# Altium schematic sheet CPU LPDDR4.SchDoc: CPU DDR
size A3; DrawnBy: UKAYACIK; Engineer: UKAYACIK; DocumentNumber: 4; Revision: B; SheetNumber: 5; SheetTotal: 21
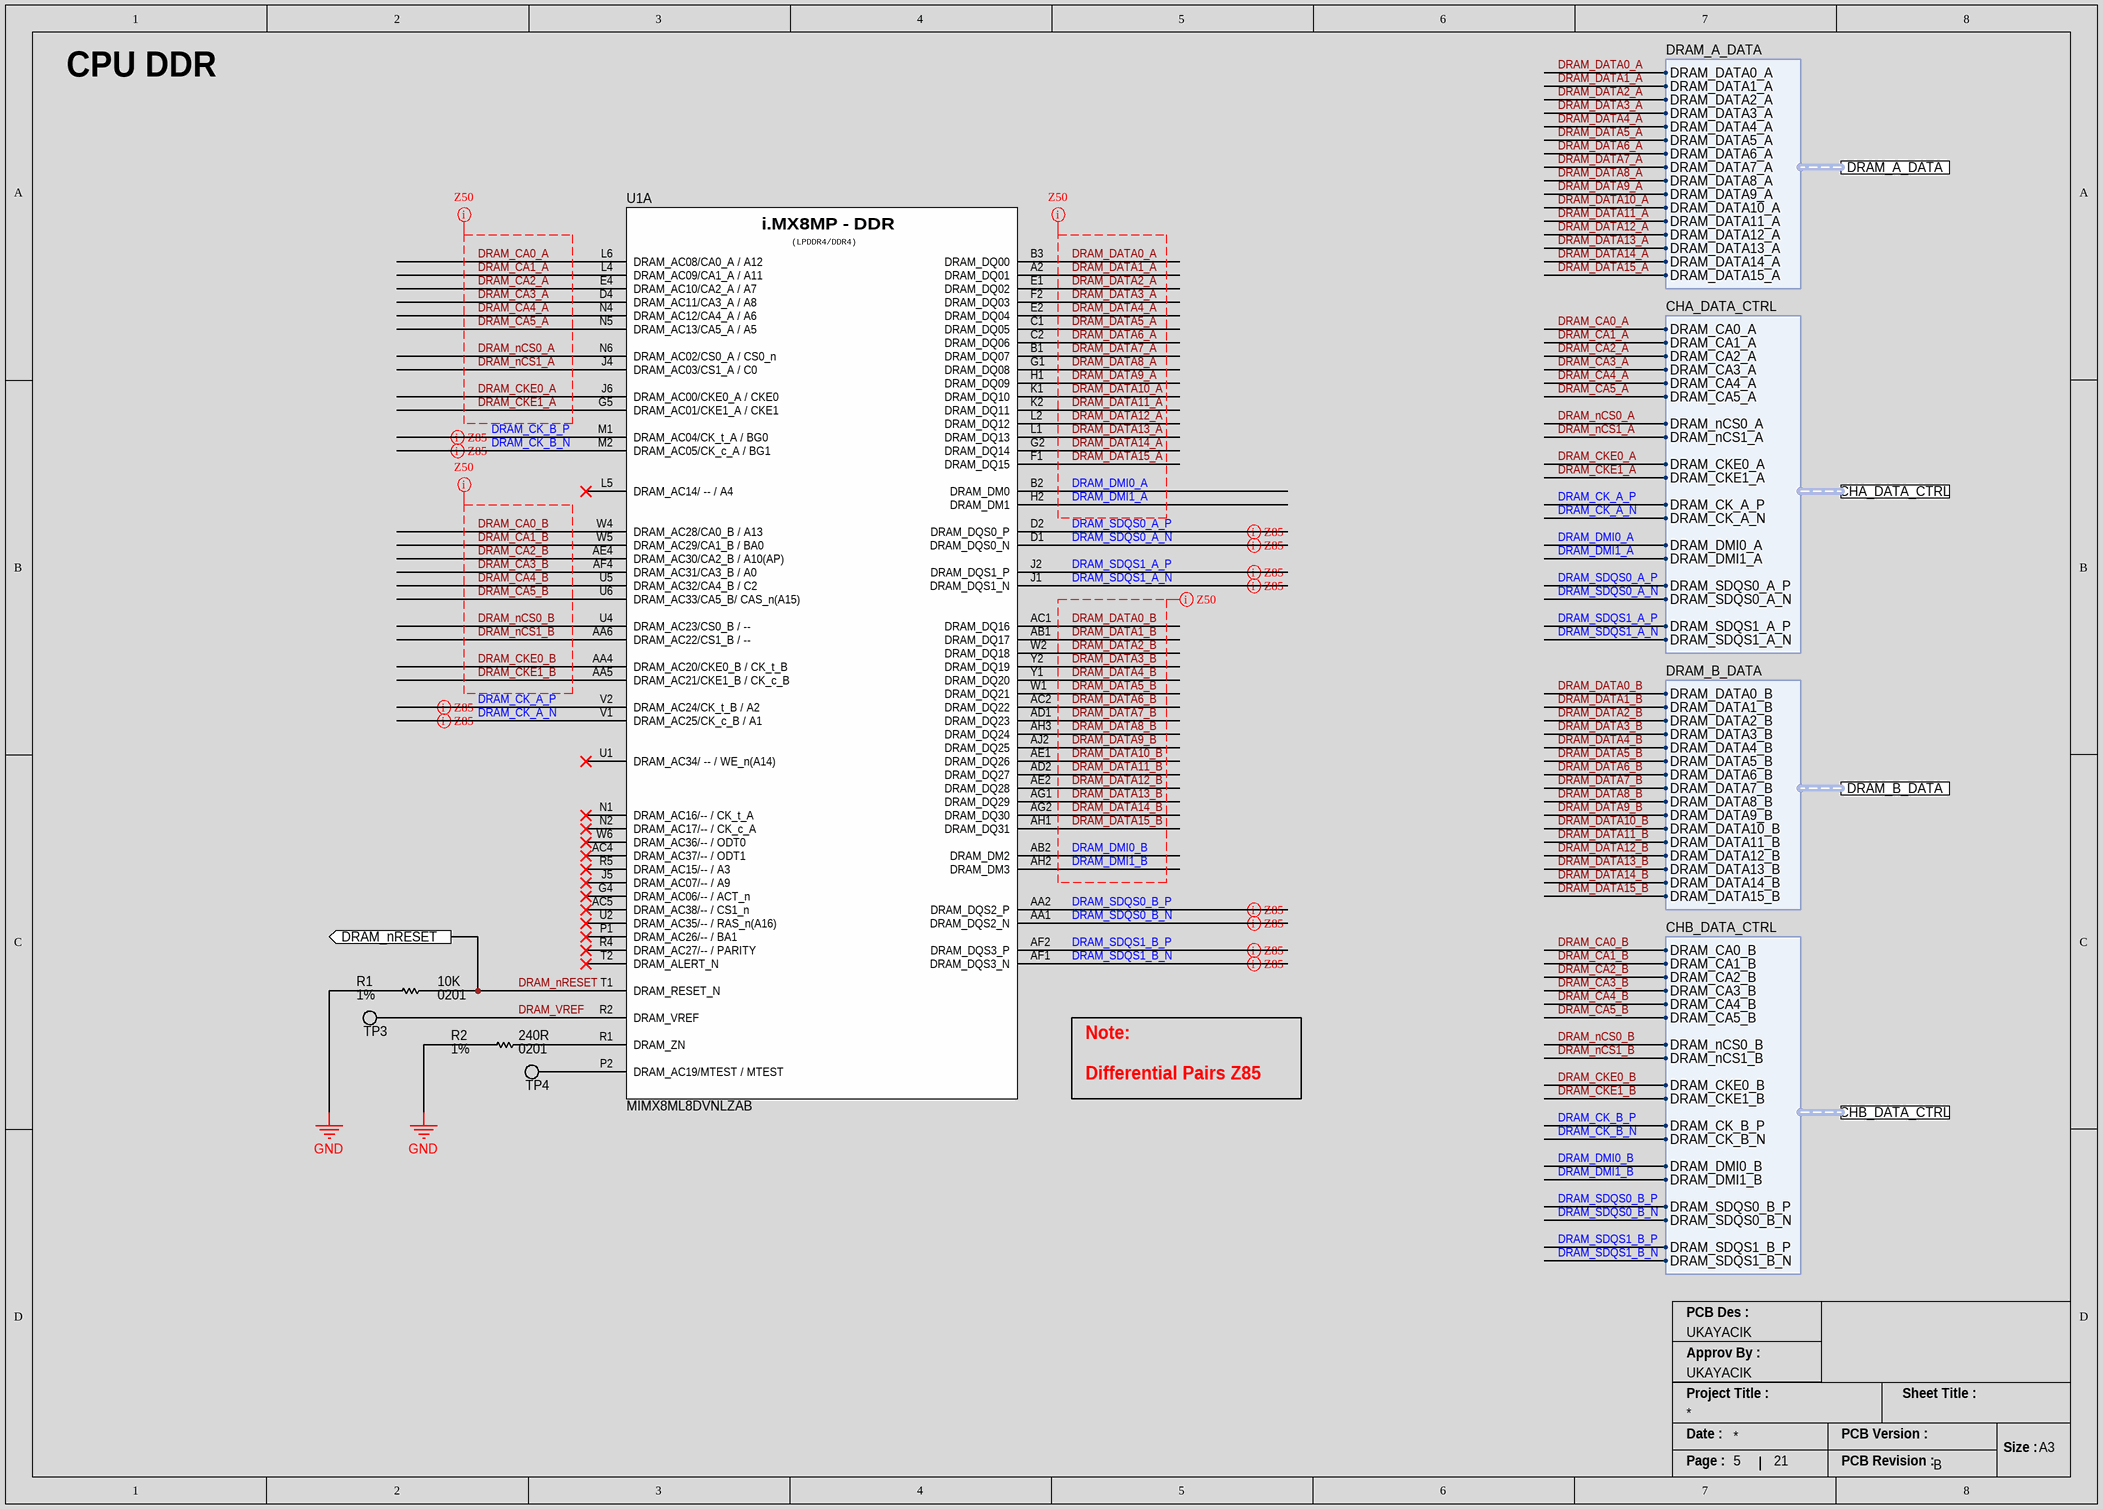
[diagram p0: CPU LPDDR4.SchDoc]

## Parts
R1  Tolerance: 1%  Resistance: 10K  Case Code (Imperial): 0201  [RES_0201_RESC0603X02N]  (hidden comment: RC0201FR-0710KL)
R2  Tolerance: 1%  Resistance: 240R  Case/Package: 0201  [RES_0201_RESC0603X02N]  (hidden comment: RC0201FR-07240RL)
TP3  NO COMPONENT  [TP_PAD_0.5MM_SMD_ROUND]  (value not drawn)  (no BOM)
TP4  NO COMPONENT  [TP_PAD_0.5MM_SMD_ROUND]  (value not drawn)  (no BOM)
U1  MIMX8ML8DVNLZAB  [IC_MPU_BGA548C50P29X29_1500X1500X148]  (part A of 15)

## Ports
CHA_DATA_CTRL (harness CHA_DATA_CTRL), CHB_DATA_CTRL (harness CHB_DATA_CTRL), DRAM_A_DATA (harness DRAM_A_DATA), DRAM_B_DATA (harness DRAM_B_DATA), DRAM_nRESET (out)

## Harnesses
DRAM_A_DATA: DRAM_DATA0_A, DRAM_DATA1_A, DRAM_DATA2_A, DRAM_DATA3_A, DRAM_DATA4_A, DRAM_DATA5_A, DRAM_DATA6_A, DRAM_DATA7_A, DRAM_DATA8_A, DRAM_DATA9_A, DRAM_DATA10_A, DRAM_DATA11_A, DRAM_DATA12_A, DRAM_DATA13_A, DRAM_DATA14_A, DRAM_DATA15_A
CHA_DATA_CTRL: DRAM_CA0_A, DRAM_CA1_A, DRAM_CA2_A, DRAM_CA3_A, DRAM_CA4_A, DRAM_CA5_A, DRAM_nCS0_A, DRAM_nCS1_A, DRAM_CKE0_A, DRAM_CKE1_A, DRAM_CK_A_P, DRAM_CK_A_N, DRAM_DMI0_A, DRAM_DMI1_A, DRAM_SDQS0_A_P, DRAM_SDQS0_A_N, DRAM_SDQS1_A_P, DRAM_SDQS1_A_N
DRAM_B_DATA: DRAM_DATA0_B, DRAM_DATA1_B, DRAM_DATA2_B, DRAM_DATA3_B, DRAM_DATA4_B, DRAM_DATA5_B, DRAM_DATA6_B, DRAM_DATA7_B, DRAM_DATA8_B, DRAM_DATA9_B, DRAM_DATA10_B, DRAM_DATA11_B, DRAM_DATA12_B, DRAM_DATA13_B, DRAM_DATA14_B, DRAM_DATA15_B
CHB_DATA_CTRL: DRAM_CA0_B, DRAM_CA1_B, DRAM_CA2_B, DRAM_CA3_B, DRAM_CA4_B, DRAM_CA5_B, DRAM_nCS0_B, DRAM_nCS1_B, DRAM_CKE0_B, DRAM_CKE1_B, DRAM_CK_B_P, DRAM_CK_B_N, DRAM_DMI0_B, DRAM_DMI1_B, DRAM_SDQS0_B_P, DRAM_SDQS0_B_N, DRAM_SDQS1_B_P, DRAM_SDQS1_B_N

## Nets
GND: R1.1 R2.1
DRAM_CA0_A: U1.L6(DRAM_AC08/CA0_A_/_A12) ; port CHA_DATA_CTRL.DRAM_CA0_A
DRAM_CA0_B: U1.W4(DRAM_AC28/CA0_B_/_A13) ; port CHB_DATA_CTRL.DRAM_CA0_B
DRAM_CA1_A: U1.L4(DRAM_AC09/CA1_A_/_A11) ; port CHA_DATA_CTRL.DRAM_CA1_A
DRAM_CA1_B: U1.W5(DRAM_AC29/CA1_B_/_BA0) ; port CHB_DATA_CTRL.DRAM_CA1_B
DRAM_CA2_A: U1.E4(DRAM_AC10/CA2_A_/_A7) ; port CHA_DATA_CTRL.DRAM_CA2_A
DRAM_CA2_B: U1.AE4(DRAM_AC30/CA2_B_/_A10(AP)) ; port CHB_DATA_CTRL.DRAM_CA2_B
DRAM_CA3_A: U1.D4(DRAM_AC11/CA3_A_/_A8) ; port CHA_DATA_CTRL.DRAM_CA3_A
DRAM_CA3_B: U1.AF4(DRAM_AC31/CA3_B_/_A0) ; port CHB_DATA_CTRL.DRAM_CA3_B
DRAM_CA4_A: U1.N4(DRAM_AC12/CA4_A_/_A6) ; port CHA_DATA_CTRL.DRAM_CA4_A
DRAM_CA4_B: U1.U5(DRAM_AC32/CA4_B_/_C2) ; port CHB_DATA_CTRL.DRAM_CA4_B
DRAM_CA5_A: U1.N5(DRAM_AC13/CA5_A_/_A5) ; port CHA_DATA_CTRL.DRAM_CA5_A
DRAM_CA5_B: U1.U6(DRAM_AC33/CA5_B/_CAS_n(A15)) ; port CHB_DATA_CTRL.DRAM_CA5_B
DRAM_CK_A_N: U1.V1(DRAM_AC25/CK_c_B_/_A1) ; port CHA_DATA_CTRL.DRAM_CK_A_N
DRAM_CK_A_P: U1.V2(DRAM_AC24/CK_t_B_/_A2) ; port CHA_DATA_CTRL.DRAM_CK_A_P
DRAM_CK_B_N: U1.M2(DRAM_AC05/CK_c_A_/_BG1) ; port CHB_DATA_CTRL.DRAM_CK_B_N
DRAM_CK_B_P: U1.M1(DRAM_AC04/CK_t_A_/_BG0) ; port CHB_DATA_CTRL.DRAM_CK_B_P
DRAM_CKE0_A: U1.J6(DRAM_AC00/CKE0_A_/_CKE0) ; port CHA_DATA_CTRL.DRAM_CKE0_A
DRAM_CKE0_B: U1.AA4(DRAM_AC20/CKE0_B_/_CK_t_B) ; port CHB_DATA_CTRL.DRAM_CKE0_B
DRAM_CKE1_A: U1.G5(DRAM_AC01/CKE1_A_/_CKE1) ; port CHA_DATA_CTRL.DRAM_CKE1_A
DRAM_CKE1_B: U1.AA5(DRAM_AC21/CKE1_B_/_CK_c_B) ; port CHB_DATA_CTRL.DRAM_CKE1_B
DRAM_DATA0_A: U1.B3(DRAM_DQ00) ; port DRAM_A_DATA.DRAM_DATA0_A
DRAM_DATA0_B: U1.AC1(DRAM_DQ16) ; port DRAM_B_DATA.DRAM_DATA0_B
DRAM_DATA1_A: U1.A2(DRAM_DQ01) ; port DRAM_A_DATA.DRAM_DATA1_A
DRAM_DATA1_B: U1.AB1(DRAM_DQ17) ; port DRAM_B_DATA.DRAM_DATA1_B
DRAM_DATA2_A: U1.E1(DRAM_DQ02) ; port DRAM_A_DATA.DRAM_DATA2_A
DRAM_DATA2_B: U1.W2(DRAM_DQ18) ; port DRAM_B_DATA.DRAM_DATA2_B
DRAM_DATA3_A: U1.F2(DRAM_DQ03) ; port DRAM_A_DATA.DRAM_DATA3_A
DRAM_DATA3_B: U1.Y2(DRAM_DQ19) ; port DRAM_B_DATA.DRAM_DATA3_B
DRAM_DATA4_A: U1.E2(DRAM_DQ04) ; port DRAM_A_DATA.DRAM_DATA4_A
DRAM_DATA4_B: U1.Y1(DRAM_DQ20) ; port DRAM_B_DATA.DRAM_DATA4_B
DRAM_DATA5_A: U1.C1(DRAM_DQ05) ; port DRAM_A_DATA.DRAM_DATA5_A
DRAM_DATA5_B: U1.W1(DRAM_DQ21) ; port DRAM_B_DATA.DRAM_DATA5_B
DRAM_DATA6_A: U1.C2(DRAM_DQ06) ; port DRAM_A_DATA.DRAM_DATA6_A
DRAM_DATA6_B: U1.AC2(DRAM_DQ22) ; port DRAM_B_DATA.DRAM_DATA6_B
DRAM_DATA7_A: U1.B1(DRAM_DQ07) ; port DRAM_A_DATA.DRAM_DATA7_A
DRAM_DATA7_B: U1.AD1(DRAM_DQ23) ; port DRAM_B_DATA.DRAM_DATA7_B
DRAM_DATA8_A: U1.G1(DRAM_DQ08) ; port DRAM_A_DATA.DRAM_DATA8_A
DRAM_DATA8_B: U1.AH3(DRAM_DQ24) ; port DRAM_B_DATA.DRAM_DATA8_B
DRAM_DATA9_A: U1.H1(DRAM_DQ09) ; port DRAM_A_DATA.DRAM_DATA9_A
DRAM_DATA9_B: U1.AJ2(DRAM_DQ25) ; port DRAM_B_DATA.DRAM_DATA9_B
DRAM_DATA10_A: U1.K1(DRAM_DQ10) ; port DRAM_A_DATA.DRAM_DATA10_A
DRAM_DATA10_B: U1.AE1(DRAM_DQ26) ; port DRAM_B_DATA.DRAM_DATA10_B
DRAM_DATA11_A: U1.K2(DRAM_DQ11) ; port DRAM_A_DATA.DRAM_DATA11_A
DRAM_DATA11_B: U1.AD2(DRAM_DQ27) ; port DRAM_B_DATA.DRAM_DATA11_B
DRAM_DATA12_A: U1.L2(DRAM_DQ12) ; port DRAM_A_DATA.DRAM_DATA12_A
DRAM_DATA12_B: U1.AE2(DRAM_DQ28) ; port DRAM_B_DATA.DRAM_DATA12_B
DRAM_DATA13_A: U1.L1(DRAM_DQ13) ; port DRAM_A_DATA.DRAM_DATA13_A
DRAM_DATA13_B: U1.AG1(DRAM_DQ29) ; port DRAM_B_DATA.DRAM_DATA13_B
DRAM_DATA14_A: U1.G2(DRAM_DQ14) ; port DRAM_A_DATA.DRAM_DATA14_A
DRAM_DATA14_B: U1.AG2(DRAM_DQ30) ; port DRAM_B_DATA.DRAM_DATA14_B
DRAM_DATA15_A: U1.F1(DRAM_DQ15) ; port DRAM_A_DATA.DRAM_DATA15_A
DRAM_DATA15_B: U1.AH1(DRAM_DQ31) ; port DRAM_B_DATA.DRAM_DATA15_B
DRAM_DMI0_A: U1.B2(DRAM_DM0) ; port CHA_DATA_CTRL.DRAM_DMI0_A
DRAM_DMI0_B: U1.AB2(DRAM_DM2) ; port CHB_DATA_CTRL.DRAM_DMI0_B
DRAM_DMI1_A: U1.H2(DRAM_DM1) ; port CHA_DATA_CTRL.DRAM_DMI1_A
DRAM_DMI1_B: U1.AH2(DRAM_DM3) ; port CHB_DATA_CTRL.DRAM_DMI1_B
DRAM_nCS0_A: U1.N6(DRAM_AC02/CS0_A_/_CS0_n) ; port CHA_DATA_CTRL.DRAM_nCS0_A
DRAM_nCS0_B: U1.U4(DRAM_AC23/CS0_B_/_--) ; port CHB_DATA_CTRL.DRAM_nCS0_B
DRAM_nCS1_A: U1.J4(DRAM_AC03/CS1_A_/_C0) ; port CHA_DATA_CTRL.DRAM_nCS1_A
DRAM_nCS1_B: U1.AA6(DRAM_AC22/CS1_B_/_--) ; port CHB_DATA_CTRL.DRAM_nCS1_B
DRAM_nRESET: R1.2 U1.T1(DRAM_RESET_N) ; port DRAM_nRESET
DRAM_SDQS0_A_N: U1.D1(DRAM_DQS0_N) ; port CHA_DATA_CTRL.DRAM_SDQS0_A_N
DRAM_SDQS0_A_P: U1.D2(DRAM_DQS0_P) ; port CHA_DATA_CTRL.DRAM_SDQS0_A_P
DRAM_SDQS0_B_N: U1.AA1(DRAM_DQS2_N) ; port CHB_DATA_CTRL.DRAM_SDQS0_B_N
DRAM_SDQS0_B_P: U1.AA2(DRAM_DQS2_P) ; port CHB_DATA_CTRL.DRAM_SDQS0_B_P
DRAM_SDQS1_A_N: U1.J1(DRAM_DQS1_N) ; port CHA_DATA_CTRL.DRAM_SDQS1_A_N
DRAM_SDQS1_A_P: U1.J2(DRAM_DQS1_P) ; port CHA_DATA_CTRL.DRAM_SDQS1_A_P
DRAM_SDQS1_B_N: U1.AF1(DRAM_DQS3_N) ; port CHB_DATA_CTRL.DRAM_SDQS1_B_N
DRAM_SDQS1_B_P: U1.AF2(DRAM_DQS3_P) ; port CHB_DATA_CTRL.DRAM_SDQS1_B_P
DRAM_VREF: TP3.1 U1.R2(DRAM_VREF)
NetR2_2: R2.2 U1.R1(DRAM_ZN)
NetTP4_1: TP4.1 U1.P2(DRAM_AC19/MTEST_/_MTEST)

Not connected (* = marked no-connect by the designer): U1 AC4(DRAM_AC37/--_/_ODT1)* AC5(DRAM_AC38/--_/_CS1_n)* G4(DRAM_AC06/--_/_ACT_n)* J5(DRAM_AC07/--_/_A9)* L5(DRAM_AC14/_--_/_A4)* N1(DRAM_AC16/--_/_CK_t_A)* N2(DRAM_AC17/--_/_CK_c_A)* P1(DRAM_AC26/--_/_BA1)* R4(DRAM_AC27/--_/_PARITY)* R5(DRAM_AC15/--_/_A3)* T2(DRAM_ALERT_N)* U1(DRAM_AC34/_--_/_WE_n(A14))* U2(DRAM_AC35/--_/_RAS_n(A16))* W6(DRAM_AC36/--_/_ODT0)*

## Layout directives
differential pair; differential pair class Z85: DRAM_CK_A_N, DRAM_CK_A_P, DRAM_CK_B_N, DRAM_CK_B_P, DRAM_SDQS0_A_N, DRAM_SDQS0_A_P, DRAM_SDQS0_B_N, DRAM_SDQS0_B_P, DRAM_SDQS1_A_N, DRAM_SDQS1_A_P, DRAM_SDQS1_B_N, DRAM_SDQS1_B_P
net class Z50: DRAM_CA0_A, DRAM_CA0_B, DRAM_CA1_A, DRAM_CA1_B, DRAM_CA2_A, DRAM_CA2_B, DRAM_CA3_A, DRAM_CA3_B, DRAM_CA4_A, DRAM_CA4_B, DRAM_CA5_A, DRAM_CA5_B, DRAM_CKE0_A, DRAM_CKE0_B, DRAM_CKE1_A, DRAM_CKE1_B, DRAM_DATA0_A, DRAM_DATA0_B, DRAM_DATA1_A, DRAM_DATA1_B, DRAM_DATA2_A, DRAM_DATA2_B, DRAM_DATA3_A, DRAM_DATA3_B, DRAM_DATA4_A, DRAM_DATA4_B, DRAM_DATA5_A, DRAM_DATA5_B, DRAM_DATA6_A, DRAM_DATA6_B, DRAM_DATA7_A, DRAM_DATA7_B, DRAM_DATA8_A, DRAM_DATA8_B, DRAM_DATA9_A, DRAM_DATA9_B, DRAM_DATA10_A, DRAM_DATA10_B, DRAM_DATA11_A, DRAM_DATA11_B, DRAM_DATA12_A, DRAM_DATA12_B, DRAM_DATA13_A, DRAM_DATA13_B, DRAM_DATA14_A, DRAM_DATA14_B, DRAM_DATA15_A, DRAM_DATA15_B, DRAM_DMI0_A, DRAM_DMI0_B, DRAM_DMI1_A, DRAM_DMI1_B, DRAM_nCS0_A, DRAM_nCS0_B, DRAM_nCS1_A, DRAM_nCS1_B

## Notes on the sheet
- CPU DDR
- Note:
- Differential Pairs Z85
- PCB Des :
- Approv By :
- Project Title :
- Sheet Title :
- Date :
- PCB Version :
- Size :
- A3
- Page :
- PCB Revision :
- (in symbol IC_MPU_8M_PLUS_MIMX8ML8DVNLZAB, part A) i.MX8MP - DDR; (LPDDR4/DDR4)

## Library data of the parts
R1 = RES_10K_1/12W_1%_0201: SMD Chip Resistor, 10 kOhm, ± 1%, 50 mW, 0201 [0603 Metric], Thick Film, General Purpose; Manufacturer: Yageo; Temperature Coefficient: 200ppm/°C; Power Rating: 50mW; Voltage Rating: 25V; Supplier 1: Digikey; Manufacturer Part Number: RC0201FR-0710KL; RoHS: Yes; Category: Chip SMD Resistors; Stock 1: 12030325; Pricing 1: 1=0.1, 10=0.027, 50=0.0172, 100=0.0143, 500=0.00988, 1000=0.00854, 5000=0.00629 (USD); Case/Package: 0201; Number of Pins: 2NUMBER; Contact Plating: Tin,Matte; Case Code (Metric): 0603; Weight: 6E-06oz; Min Operating Temperature: -55°C; Max Operating Temperature: 125°C; Packaging: Tape and Reel; Package Quantity: 10000; Termination: SMD/SMT; Resistor Type: Thick Film; Series: RC; Number of Terminations: 2; Max Power Dissipation: 50mW; Working Voltage: 25V; Features: Moisture Resistant; Technology: THICK FILM; Resistance Tolerance: 1%; Construction: Rectangular; Voltage Rating (DC): 25V; Length: 0.6mm; Width: 0.012inch; Height: 0.01inch; Depth: 0.3mm; RoHS Compliant: Yes; Reach SVHC Compliant: No; Military Standard: Not; Lead Free: 5697LeadFree; ComponentLink1URL: https://datasheet.ciiva.com/7660/1421516-7660807.pdf?src-supplier=Element14; ComponentLink1Description: https://datasheet.ciiva.com/7660/1421516-7660807.pdf?src-supplier=Element14; ComponentLink2URL: https://datasheet.ciiva.com/46391/1421516-46391339.pdf?src-supplier=Element14; ComponentLink2Description: https://datasheet.ciiva.com/46391/1421516-46391339.pdf?src-supplier=Element14; ComponentLink3URL: https://datasheet.ciiva.com/2467/pyu-r-int-thick-7-2467110.pdf?src-supplier=Digikey; ComponentLink3Description: https://datasheet.ciiva.com/2467/pyu-r-int-thick-7-2467110.pdf?src-supplier=Digikey; ComponentLink4URL: https://datasheet.ciiva.com/2467/pyu-r-int-thick-7-2467111.pdf?src-supplier=Digikey; ComponentLink4Description: https://datasheet.ciiva.com/2467/pyu-r-int-thick-7-2467111.pdf?src-supplier=Digikey; ComponentLink5URL: https://datasheet.ciiva.com/2467/pyu-r-int-thick-7-2467109.pdf?src-supplier=Digikey; ComponentLink5Description: https://datasheet.ciiva.com/2467/pyu-r-int-thick-7-2467109.pdf?src-supplier=Digikey; ComponentLink6URL: https://datasheet.ciiva.com/26829/getdatasheetpartid-421074-26829851.pdf?src-supplier=Verical; ComponentLink6Description: https://datasheet.ciiva.com/26829/getdatasheetpartid-421074-26829851.pdf?src-supplier=Verical; ComponentLink7URL: https://datasheet.ciiva.com/8891/pyu-rc0201-51-rohs-l-8-8891384.pdf?src-supplier=Avnet; ComponentLink7Description: https://datasheet.ciiva.com/8891/pyu-rc0201-51-rohs-l-8-8891384.pdf?src-supplier=Avnet; Supplier Part Number 1: 311-10.0KMCT-ND
R2 = RES_240R_1%_50mW_0201: SMD Chip Resistor, 240 Ohm, ± 1%, 50 mW, 0201 [0603 Metric], Thick Film, General Purpose; Manufacturer: Yageo; Power Rating: 50mW; Temperature Coefficient: 200ppm/°C; Supplier 1: Digikey; Manufacturer Part Number: RC0201FR-07240RL; RoHS: Yes; Category: Chip SMD Resistors; Stock 1: 736295; Pricing 1: 1=0.1, 10=0.027, 50=0.0172, 100=0.0143, 500=0.00988, 1000=0.00854, 5000=0.00629 (USD); Mount: Surface Mount; Case Code (Metric): 0603; Case Code (Imperial): 0201; Size Code: 0201; Min Operating Temperature: -55°C; Max Operating Temperature: 125°C; Packaging: Cut Tape; Number of Terminations: 2; Max Power Dissipation: 50mW; Features: Moisture Resistant; Series: RC; Lead Free: Lead Free; RoHS Compliant: Yes; ComponentLink1URL: https://datasheet.octopart.com/RC0201FR-07240RL-Yageo-datasheet-164759695.pdf?src-supplier=Future+Electronics; ComponentLink1Description: https://datasheet.octopart.com/RC0201FR-07240RL-Yageo-datasheet-164759695.pdf?src-supplier=Future+Electronics; ComponentLink2URL: http://www.yageo.com/documents/recent/PYu-RC0201_51_RoHS_L_(8).pdf?src-supplier=Future+Electronics; ComponentLink2Description: http://www.yageo.com/documents/recent/PYu-RC0201_51_RoHS_L_(8).pdf?src-supplier=Future+Electronics; ComponentLink3URL: https://datasheet.octopart.com/RC0201FR-07240RL-Yageo-datasheet-148775077.pdf?src-supplier=TME; ComponentLink3Description: https://datasheet.octopart.com/RC0201FR-07240RL-Yageo-datasheet-148775077.pdf?src-supplier=TME; Supplier Part Number 1: YAG2528DKR-ND
TP3 TP4 = TP_PAD_SMD_SMALL: Test Point, SMD pad, round, 1.5mm, 1.6mm, 3mm diameter
U1 = IC_MPU_8M_PLUS_MIMX8ML8DVNLZAB: i.MX 8M Plus, Consumer, / TRAY TRAY MULTIPLE DP BAKEABLE RoHS Compliant: Yes; Manufacturer: NXP Semiconductors; Supplier 1: Arrow Electronics; Manufacturer Part Number: MIMX8ML8DVNLZAB; RoHS: Yes; Category: Microprocessors; Stock 1: 1036; Pricing 1: 1=54.8, 5=52.24, 10=44.19, 25=42.8, 50=39.95, 100=31.83 (USD); Supplier Part Number 1: MIMX8ML8DVNLZAB